# EAGLE design drive-adaptor (EAGLE 7.3.0)
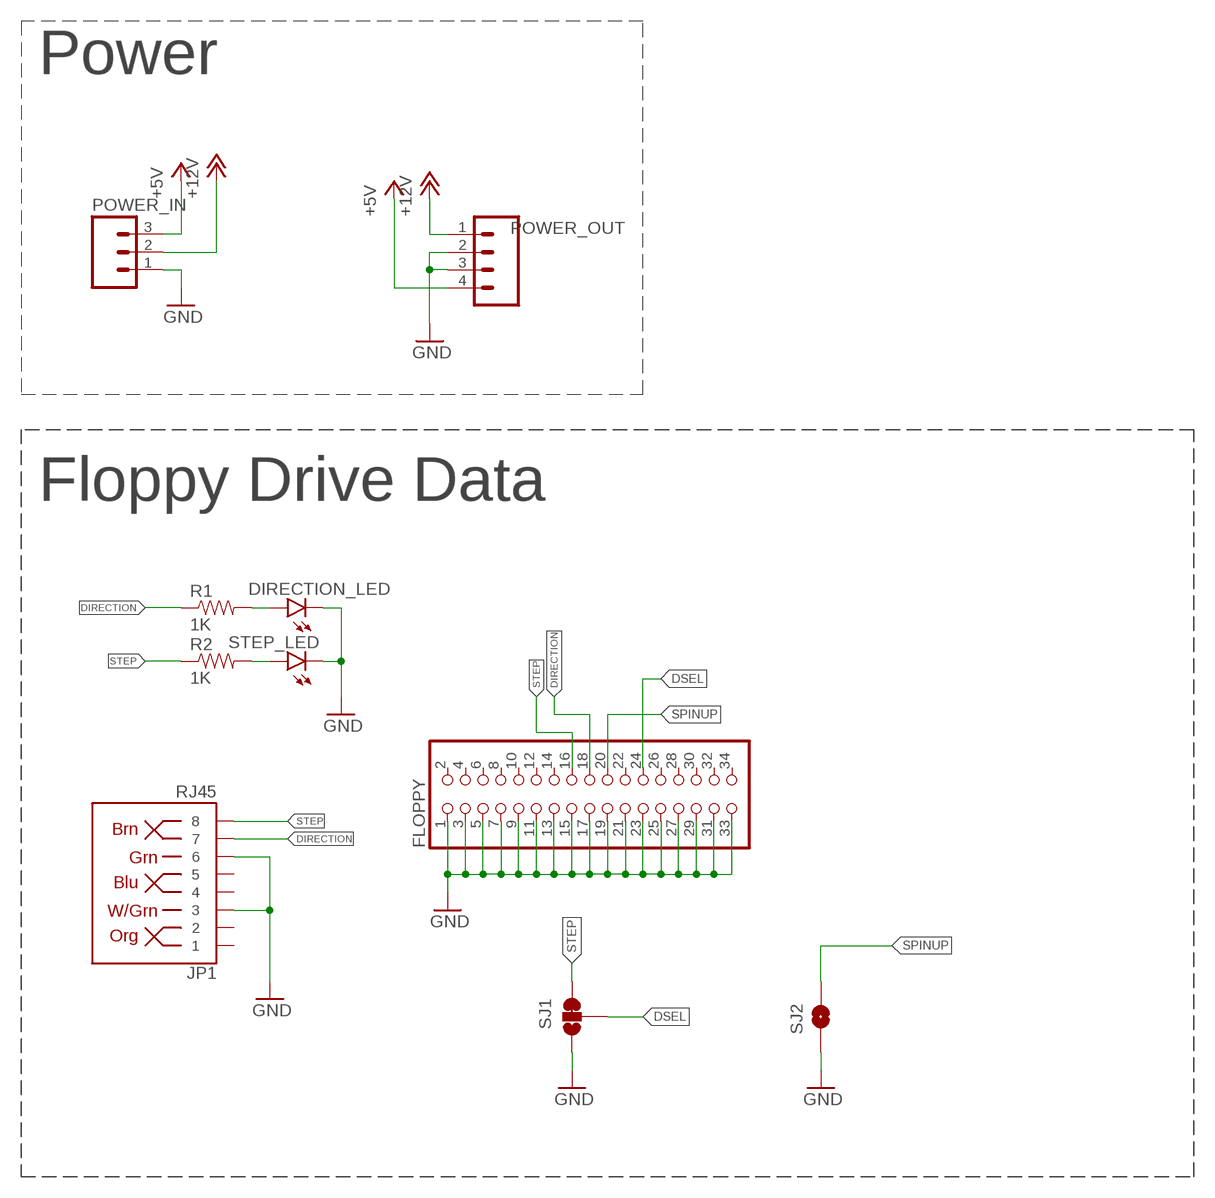
[diagram p0: schematic, sheet 1]

## Parts
DIRECTION_LED  LED1206  [LED-1206]
FLOPPY  PINHD-2X17  [2X17]
JP1  RJ45  RJ45-8PTH  [RJ45-8]
POWER_IN  M03-SCREW-5MM  [SCREWTERMINAL-5MM-3]
POWER_OUT  M04LONGPADS  [1X04_LONGPADS]
R1  1K  1KOHM-1/10W-1%(0603)  [0603-RES]
R2  1K  1KOHM-1/10W-1%(0603)  [0603-RES]
SJ1  JUMPER-PAD-3-2OF3_NC_BY_TRACE_SMALL  [PAD-JUMPER-3-2OF3_NC_BY_TRACE_YES_SILK_FULL_BOX]
SJ2  JUMPER-PAD-2-NOYES_SILK  [PAD-JUMPER-2-NO_YES_SILK]
STEP_LED  LED1206  [LED-1206]

## Nets
+5V: POWER_IN.3 POWER_OUT.4
+12V: POWER_IN.2 POWER_OUT.1
DIRECTION: FLOPPY.18 JP1.7 R1.1
DSEL: FLOPPY.24 SJ1.2
GND: DIRECTION_LED.C FLOPPY.1 FLOPPY.3 FLOPPY.5 FLOPPY.7 FLOPPY.9 FLOPPY.11 FLOPPY.13 FLOPPY.15 FLOPPY.17 FLOPPY.19 FLOPPY.21 FLOPPY.23 FLOPPY.25 FLOPPY.27 FLOPPY.29 FLOPPY.31 FLOPPY.33 JP1.3 JP1.6 POWER_IN.1 POWER_OUT.2 POWER_OUT.3 SJ1.1 SJ2.1 STEP_LED.C
N$1: DIRECTION_LED.A R1.2
N$2: R2.2 STEP_LED.A
SPINUP: FLOPPY.20 SJ2.2
STEP: FLOPPY.16 JP1.8 R2.1 SJ1.3
Unconnected: FLOPPY.2 FLOPPY.4 FLOPPY.6 FLOPPY.8 FLOPPY.10 FLOPPY.12 FLOPPY.14 FLOPPY.22 FLOPPY.26 FLOPPY.28 FLOPPY.30 FLOPPY.32 FLOPPY.34 JP1.1 JP1.2 JP1.4 JP1.5

## Notes on the sheet
- Power
- Floppy Drive Data

## Library data of the parts
DIRECTION_LED STEP_LED = SparkFun-LED:LED: LEDs Standard schematic elements and footprints for 5mm, 3mm, 1206, and 0603 sized LEDs. 5mm - Spark Fun Electronics SKU : COM-00529 (and others)
FLOPPY = pinhead:PINHD-2X17: PIN HEADER
JP1 = SparkFun-Connectors:RJ45-8: RJ45 Jack Simple RJ45, 8-pin connection - connector for common Cat5, Cat5e, and Cat6 Ethernet cables. Footprint not yet proven in production. Connector sku is PRT-00643; Breakout PCB sku is BOB-00716.; PROD_ID: CONN-08506
POWER_IN = SparkFun-Connectors:M03: Header 3 Standard 3-pin 0.1" header. Use with straight break away headers (SKU : PRT-00116), right angle break away headers (PRT-00553), swiss pins (PRT-00743), machine pins (PRT-00117), and female headers (PRT-00115). Molex polarized connector foot print use with SKU : PRT-08232 with associated crimp pins and housings.; STOREFRONT_ID: PRT-08433
POWER_OUT = SparkFun-Connectors:M04: Header 4 Standard 4-pin 0.1" header. Use with straight break away headers (SKU : PRT-00116), right angle break away headers (PRT-00553), swiss pins (PRT-00743), machine pins (PRT-00117), and female headers (PRT-00115). Molex polarized connector foot print use with SKU : PRT-08231 with associated crimp pins and housings. 1MM SMD Version SKU: PRT-10208
R1 R2 = SparkFun-Resistors:1KOHM-1/10W-1%(0603): RES-07856; PROD_ID: RES-07856
SJ1 = SparkFun-Passives:JUMPER-PAD-3-2OF3_NC_BY_TRACE
SJ2 = SparkFun-Passives:JUMPER-PAD-2-NO

## Board
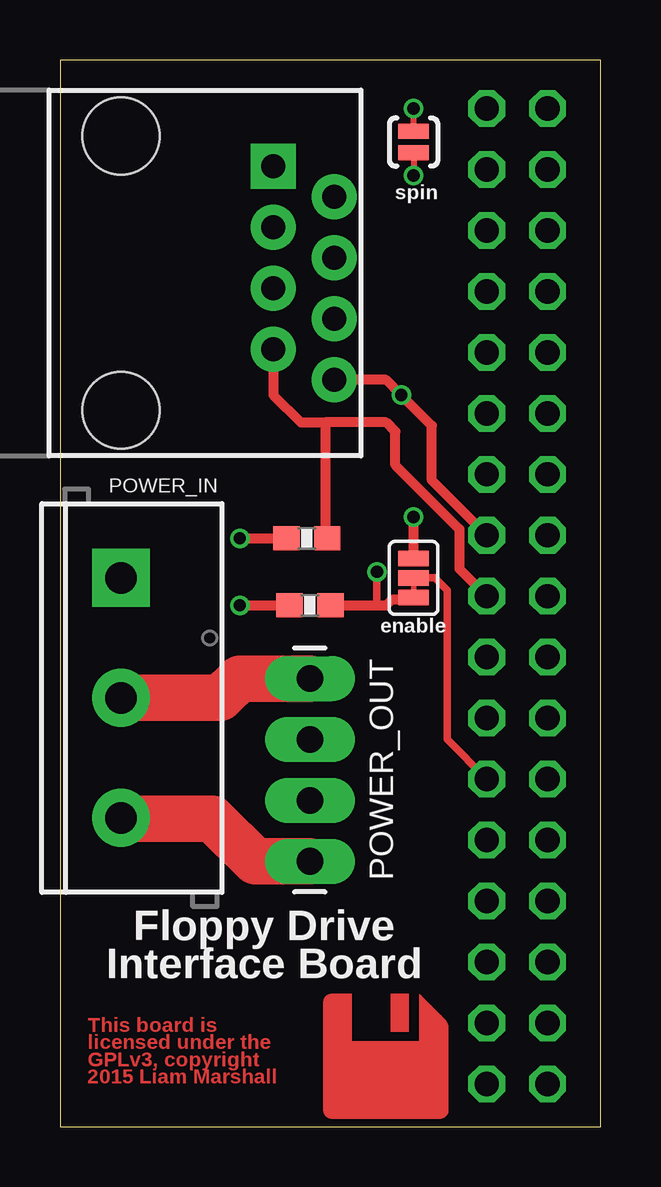
[diagram p1: board, top side]
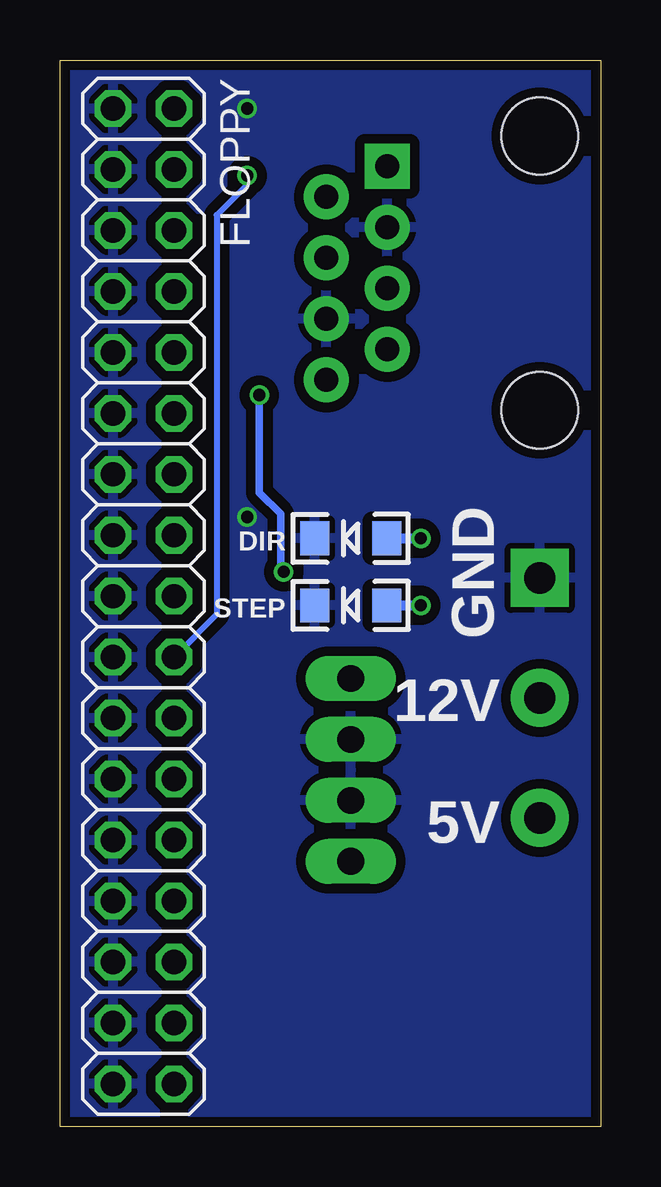
[diagram p2: board, bottom side, seen from below]

Size 22.53 x 44.44 mm. Coordinates in mm from the lower left corner, seen from the top.
Outline: 0,0 22.53,0 22.53,44.44 0,44.44 0,0
Copper layers (1*16): Top 0.035mm / dielectric 1.5mm / Bottom 0.035mm
Design rules "dirt_cheap_dirty_boards.v1": minimum track width 5mil, minimum drill 12mil, track to track 5mil, track to pad 5mil, pad to pad 5mil, via to via 5mil, smd to smd 0mil, copper to edge 10mil, drill to drill 10mil, minimum pad ring 10mil, minimum via ring 6mil, stop-mask expansion 2mil, vias tented up to drill 25mil, thermal gap 10mil

### Footprints (pad centres in the part's own frame; a part is rotated, then mirrored left to right if it is on the bottom)
LED-1206 = smd 1.2 x 1.4: A -1.5,0; C 1.5,0
2X17 = drill 1.016 octagon: 1 -20.32,-1.27; 2 -20.32,1.27; 3 -17.78,-1.27; 4 -17.78,1.27; 5 -15.24,-1.27; 6 -15.24,1.27; 7 -12.7,-1.27; 8 -12.7,1.27; 9 -10.16,-1.27; 10 -10.16,1.27; 11 -7.62,-1.27; 12 -7.62,1.27; 13 -5.08,-1.27; 14 -5.08,1.27; 15 -2.54,-1.27; 16 -2.54,1.27; 17 0,-1.27; 18 0,1.27; 19 2.54,-1.27; 20 2.54,1.27; 21 5.08,-1.27; 22 5.08,1.27; 23 7.62,-1.27; 24 7.62,1.27; 25 10.16,-1.27; 26 10.16,1.27; 27 12.7,-1.27; 28 12.7,1.27; 29 15.24,-1.27; 30 15.24,1.27; 31 17.78,-1.27; 32 17.78,1.27; 33 20.32,-1.27; 34 20.32,1.27
RJ45-8 = drill 1 pad 1.88 square: 1 -4.445,6.35 | drill 1 pad 1.88: 2 -3.175,8.89; 3 -1.905,6.35; 4 -0.635,8.89; 5 0.635,6.35; 6 1.905,8.89; 7 3.175,6.35; 8 4.445,8.89 | hole 3.2: -5.715,0; 5.715,0
SCREWTERMINAL-5MM-3 = drill 1.3 pad 2.413 square: 1 0,0 | drill 1.3 pad 2.413: 2 5,0; 3 10,0
1X04_LONGPADS = drill 1.118 pad 1.88 long: 1 0,0; 2 2.54,0; 3 5.08,0; 4 7.62,0
0603-RES = smd 1.1 x 1: 1 -0.85,0; 2 0.85,0
PAD-JUMPER-3-2OF3_NC_BY_TRACE_YES_SILK_FULL_BOX = smd 0.635 x 1.27: 1 -0.813,0; 2 0,0; 3 0.813,0
PAD-JUMPER-2-NO_YES_SILK = smd 0.635 x 1.27: 1 -0.45,0; 2 0.45,0

### Placement (x,y rotation side)
DIRECTION_LED  10.41,24.51 180 bottom
FLOPPY  19.05,22.1 270 bottom
JP1  2.54,35.56 270 top
POWER_IN  2.54,22.86 270 top
POWER_OUT  10.41,18.67 270 top
R1  10.29,24.51 180 top
R2  10.41,21.72 180 top
SJ1  14.73,22.86 270 top
SJ2  14.73,41.02 270 top
STEP_LED  10.41,21.72 180 bottom

### Tracks (layer width: path | path; a pad name or v marks a point on that pad's centre or on a via)
+5V
  Top 1.93: POWER_OUT.4 8.13,11.05 6.35,12.83 2.57,12.83 POWER_IN.3
+12V
  Top 1.93: POWER_IN.2 6.68,17.86 7.49,18.67 POWER_OUT.1
DIRECTION
  Top 0.406: JP1.7 8.89,30.48 10.03,29.34 11.05,29.34 | FLOPPY.18 16.64,23.24 16.64,24.89 13.97,27.56 13.97,28.96 13.59,29.34 11.05,29.34 | 11.05,29.34 11.05,24.6 R1.1
DSEL
  Top 0.203: 14.73,22.23 SJ1.2
  Top 0.305: SJ1.2 15.62,22.86 16.13,22.35 16.13,16.13 FLOPPY.24
GND  (via drill 0.51)
  Top 0.254: SJ2.1 v14.73,42.42
  Top 0.406: SJ1.1 v14.73,25.4
  pour Bottom (isolate 0.406): -3.81,48.26 -3.81,-6.35 25.4,-6.35 25.4,48.26
N$1  (via drill 0.51)
  Top 0.406: v7.49,24.51 R1.2
  Bottom 0.406: DIRECTION_LED.A v7.49,24.51
N$2  (via drill 0.51)
  Top 0.406: v7.49,21.72 R2.2
  Bottom 0.406: STEP_LED.A v7.49,21.72
SPINUP  (via drill 0.51)
  Top 0.254: SJ2.2 v14.73,39.62
  Bottom 0.254: v14.73,39.62 14.73,39.24 16,37.97 16,21.34 FLOPPY.20
STEP  (via drill 0.51)
  Top 0.305: v13.21,23.11 13.21,21.72
  Top 0.406: R2.1 13.21,21.72 13.59,21.72 13.84,21.97 14.66,21.97 SJ1.3 | FLOPPY.16 15.49,26.92 15.49,29.21 v14.22,30.48 13.59,31.11 JP1.8
  Bottom 0.305: v14.22,30.48 14.22,26.42 13.34,25.53 13.34,23.24 v13.21,23.11
(copper drawn outside any net)
  shapes: Top area x861

### Text on the board
Top: This board is / licensed under the / GPLv3, copyright / 2015 Liam Marshall
tPlace: spin | enable | Floppy Drive / Interface Board
bPlace: DIR | STEP | GND | 12V | 5V